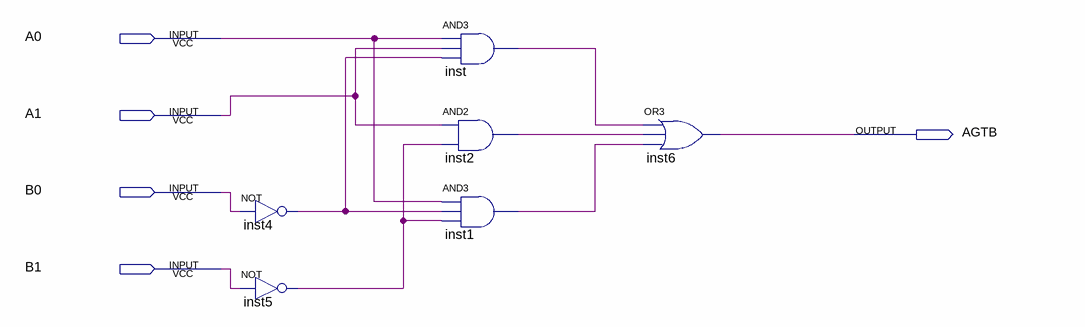
[diagram p0: schematic sheet]
// Quartus schematic AGTB.bdf as structural Verilog: 6 symbols, 5 pins
module AGTB (
  input  A0,
  input  A1,
  input  B0,
  input  B1,
  output AGTB
);

  wire inst1_out, inst2_out, inst4_out, inst5_out, inst_out;

  not inst4 (inst4_out, B0);
  not inst5 (inst5_out, B1);
  and inst (inst_out, A0, A1, inst4_out);
  and inst2 (inst2_out, A1, inst5_out);
  and inst1 (inst1_out, A0, inst4_out, inst5_out);
  or inst6 (AGTB, inst_out, inst2_out, inst1_out);
endmodule
